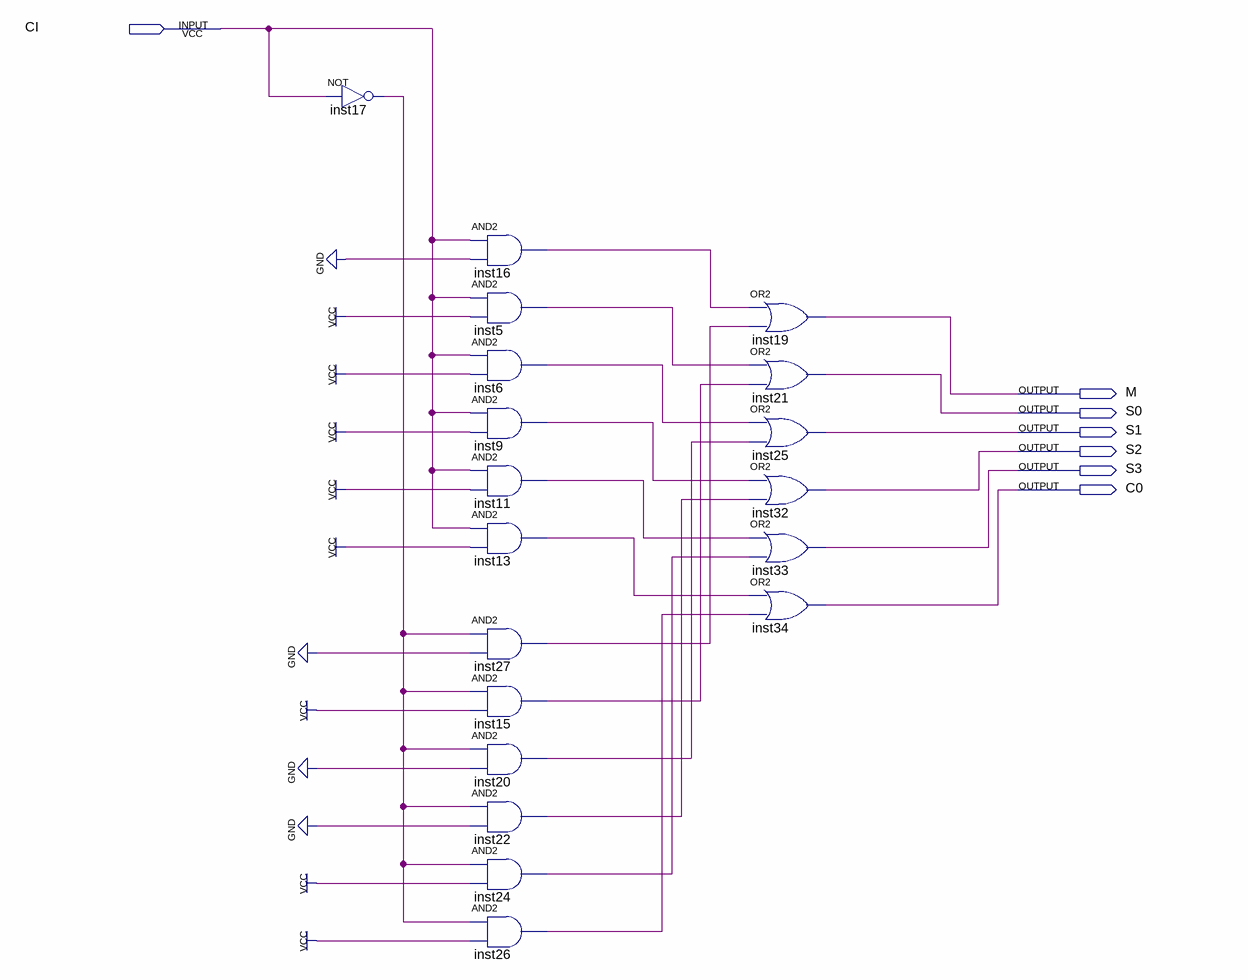
[diagram p0: schematic sheet]
// Quartus schematic cALU.bdf as structural Verilog: 19 symbols, 7 pins
module cALU (
  input  CI,
  output M,
  output S0,
  output S1,
  output S2,
  output S3,
  output C0
);

  wire inst5_out, inst6_out, inst9_out, inst11_out, inst13_out, inst15_out, inst16_out, inst17_out,
       inst20_out, inst22_out, inst24_out, inst26_out, inst27_out;

  not inst17 (inst17_out, CI);
  and inst16 (inst16_out, CI, 1'b0);
  and inst5 (inst5_out, CI, 1'b1);
  and inst6 (inst6_out, CI, 1'b1);
  and inst9 (inst9_out, CI, 1'b1);
  and inst11 (inst11_out, CI, 1'b1);
  and inst13 (inst13_out, CI, 1'b1);
  and inst27 (inst27_out, inst17_out, 1'b0);
  and inst15 (inst15_out, inst17_out, 1'b1);
  and inst20 (inst20_out, inst17_out, 1'b0);
  and inst22 (inst22_out, inst17_out, 1'b0);
  and inst24 (inst24_out, inst17_out, 1'b1);
  and inst26 (inst26_out, inst17_out, 1'b1);
  or inst19 (M, inst16_out, inst27_out);
  or inst21 (S0, inst5_out, inst15_out);
  or inst25 (S1, inst6_out, inst20_out);
  or inst32 (S2, inst9_out, inst22_out);
  or inst33 (S3, inst11_out, inst24_out);
  or inst34 (C0, inst13_out, inst26_out);
endmodule
